# Altium schematic sheet MCU.SchDoc
size D; SheetNumber: 3; SheetTotal: 7
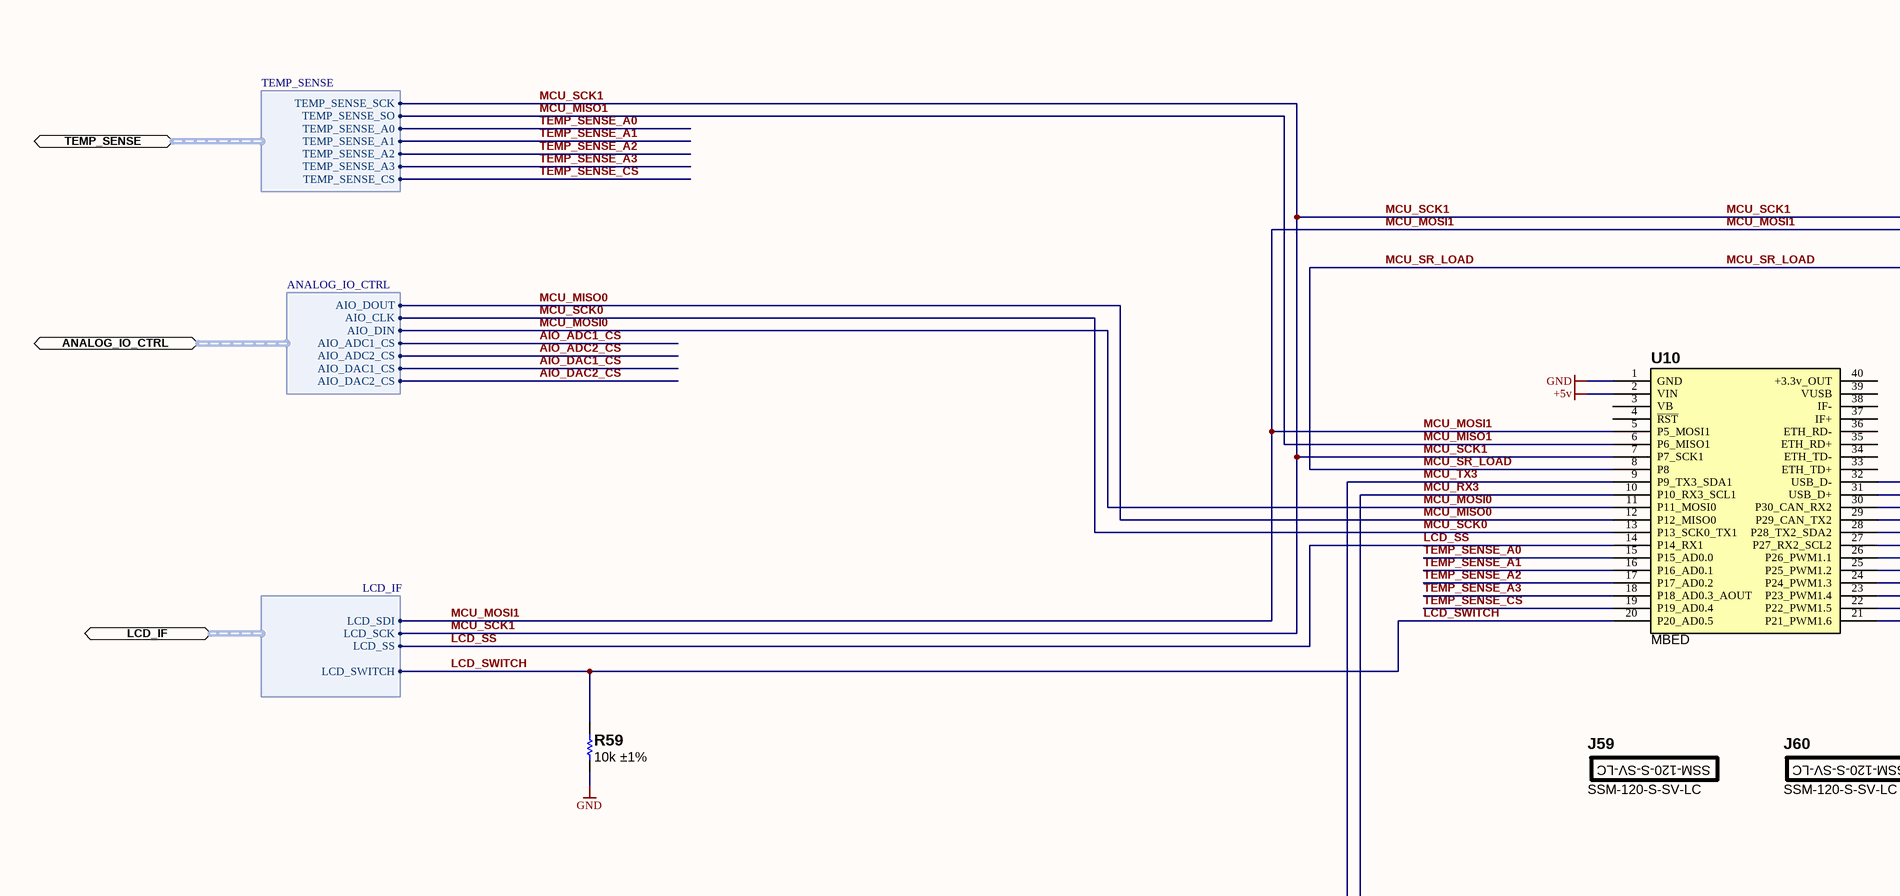
[diagram p0: MCU.SchDoc, top left]
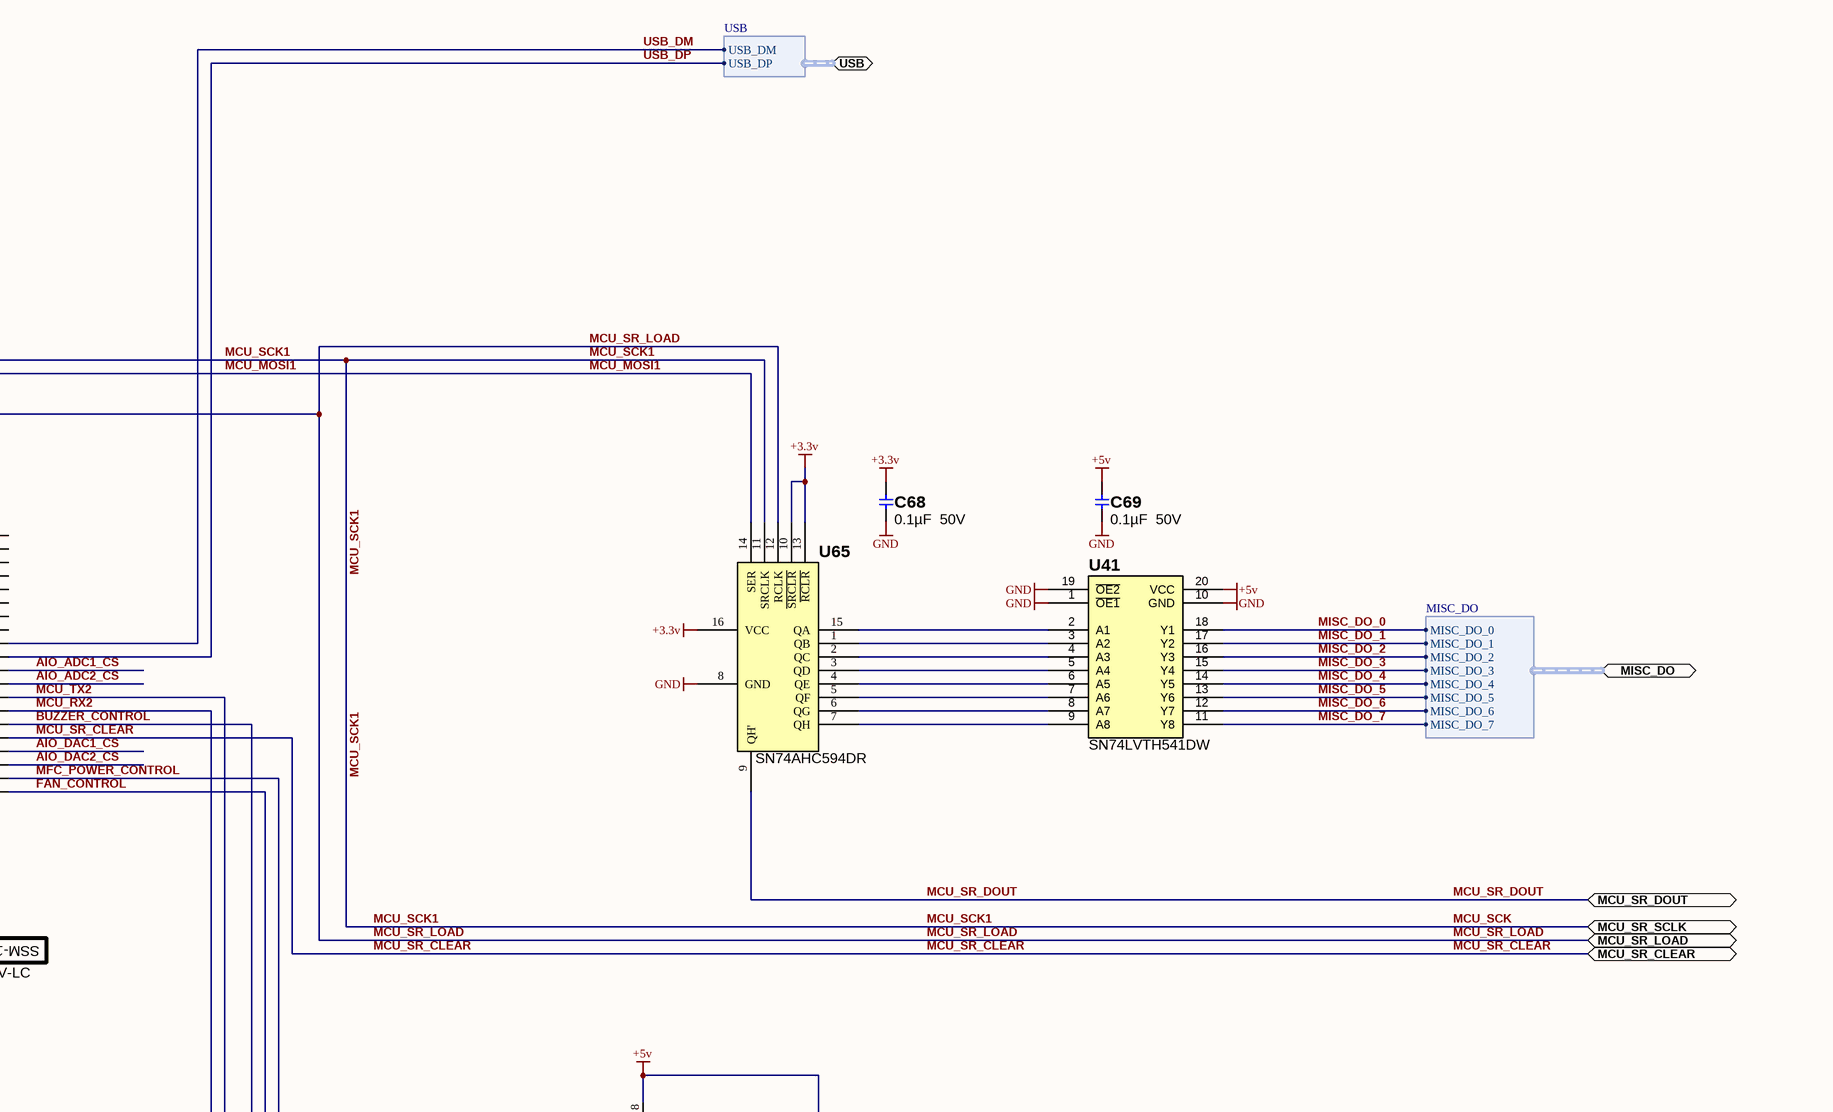
[diagram p1: MCU.SchDoc, top right]
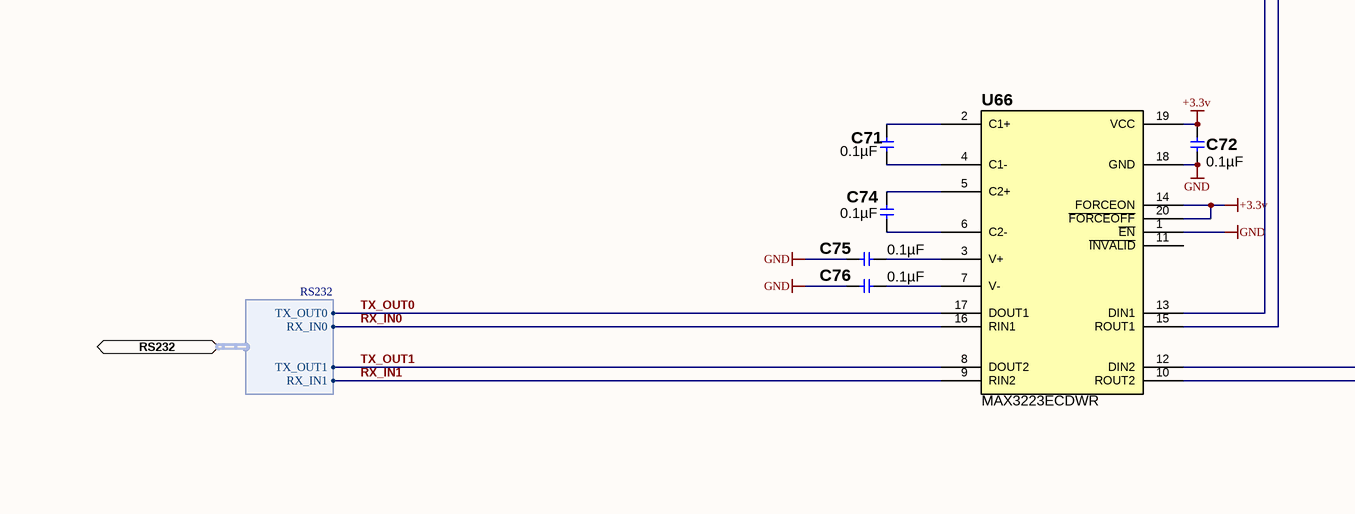
[diagram p2: MCU.SchDoc, bottom left]
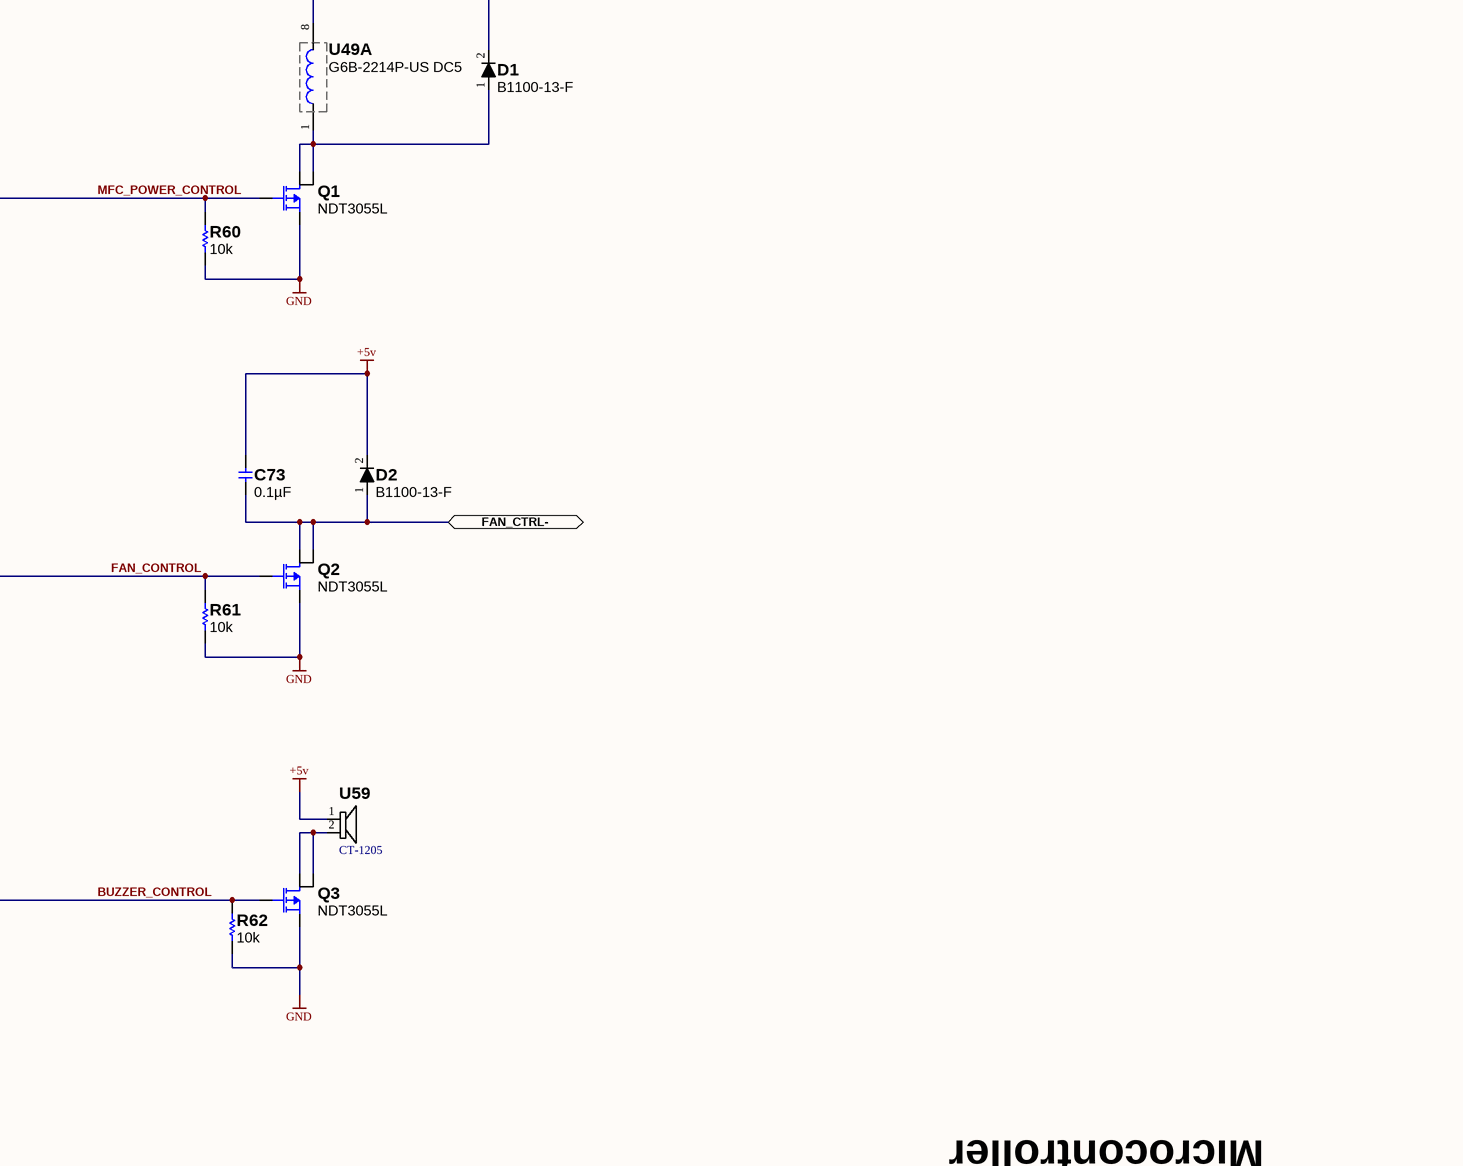
[diagram p3: MCU.SchDoc, bottom right]

## Parts
C68  0.1µF  50V  [C0805_LD]
C69  0.1µF  50V  [C0805_LD]
C71  0.1µF  [C0805_LD]
C72  0.1µF  [C0805_LD]
C73  0.1µF  [C0805_LD]
C74  0.1µF  [C0805_LD]
C75  0.1µF  [C0805_LD]
C76  0.1µF  [C0805_LD]
D1  B1100-13-F  [D_SMA_P]
D2  B1100-13-F  [D_SMA_P]
J59  SSM-120-S-SV-LC  (mechanical)
J60  SSM-120-S-SV-LC  (mechanical)
Q1  NDT3055L  [SOT223]
Q2  NDT3055L  [SOT223]
Q3  NDT3055L  [SOT223]
R59  10k ±1%  [R0805_LD]
R60  10k  [R0805_LD]
R61  10k  [R0805_LD]
R62  10k  [R0805_LD]
U10  MBED  [MBED_SURFACEMOUNT_SOCKET]
U41  SN74LVTH541DW  [SOIC127P1030X265-20L]
U49  G6B-2214P-US DC5  [G6B-2214P-US]  (part A of 2)
U59  CT-1205  [CT-1205]
U65  SN74AHC594DR  [SOIC127P600X145-16L]
U66  MAX3223ECDWR  [SOIC127P1030X265-20L]

## Ports
ANALOG_IO_CTRL (harness ANALOG_IO_CTRL), FAN_CTRL-, LCD_IF (harness LCD_IF), MCU_SR_CLEAR, MCU_SR_DOUT, MCU_SR_LOAD, MCU_SR_SCLK, MISC_DO (harness MISC_DO), RS232 (harness RS232), TEMP_SENSE (harness TEMP_SENSE), USB (harness USB)

## Harnesses
ANALOG_IO_CTRL: AIO_DOUT, AIO_CLK, AIO_DIN, AIO_ADC1_CS, AIO_ADC2_CS, AIO_DAC1_CS, AIO_DAC2_CS
TEMP_SENSE: TEMP_SENSE_SCK, TEMP_SENSE_SO, TEMP_SENSE_A0, TEMP_SENSE_A1, TEMP_SENSE_A2, TEMP_SENSE_A3, TEMP_SENSE_CS
LCD_IF: LCD_SWITCH, LCD_SDI, LCD_SCK, LCD_SS
MISC_DO: MISC_DO_0, MISC_DO_1, MISC_DO_2, MISC_DO_3, MISC_DO_4, MISC_DO_5, MISC_DO_6, MISC_DO_7
RS232: TX_OUT0, RX_IN0, TX_OUT1, RX_IN1
USB: USB_DM, USB_DP

## Nets
+3.3v: C68.2 C72.2 U65.10(~{SRCLR}) U65.13(~{RCLR}) U65.16(VCC) U66.14(FORCEON) U66.19(VCC) U66.20(~{FORCEOFF})
+5v: C69.2 C73.2 D1.2(K) D2.2(K) U10.2(VIN) U41.20(VCC) U49.8 U59.1(+)
GND: C68.1 C69.1 C72.1 C75.1 C76.1 Q1.3(S) Q2.3(S) Q3.3(S) R59.1 R60.1 R61.1 R62.1 U10.1(GND) U41.1(~{OE1}) U41.10(GND) U41.19(~{OE2}) U65.8(GND) U66.1(~{EN}) U66.18(GND)
AIO_ADC1_CS: U10.30(P30_CAN_RX2) ; port ANALOG_IO_CTRL.AIO_ADC1_CS
AIO_ADC2_CS: U10.29(P29_CAN_TX2) ; port ANALOG_IO_CTRL.AIO_ADC2_CS
AIO_DAC1_CS: U10.24(P24_PWM1.3) ; port ANALOG_IO_CTRL.AIO_DAC1_CS
AIO_DAC2_CS: U10.23(P23_PWM1.4) ; port ANALOG_IO_CTRL.AIO_DAC2_CS
BUZZER_CONTROL: Q3.1(G) R62.2 U10.26(P26_PWM1.1)
FAN_CONTROL: Q2.1(G) R61.2 U10.21(P21_PWM1.6)
FAN_CTRL-: C73.1 D2.1(A) Q2.2(D) Q2.4(D) ; port FAN_CTRL-
LCD_SS: U10.14(P14_RX1) ; port LCD_IF.LCD_SS
LCD_SWITCH: R59.2 U10.20(P20_AD0.5) ; port LCD_IF.LCD_SWITCH
MCU_MISO0: U10.12(P12_MISO0) ; port ANALOG_IO_CTRL.AIO_DOUT
MCU_MISO1: U10.6(P6_MISO1) ; port TEMP_SENSE.TEMP_SENSE_SO
MCU_MOSI0: U10.11(P11_MOSI0) ; port ANALOG_IO_CTRL.AIO_DIN
MCU_MOSI1: U10.5(P5_MOSI1) U65.14(SER) ; port LCD_IF.LCD_SDI
MCU_RX2: U10.27(P27_RX2_SCL2) U66.10(ROUT2)
MCU_RX3: U10.10(P10_RX3_SCL1) U66.15(ROUT1)
MCU_SCK: U10.7(P7_SCK1) U65.11(SRCLK) ; port MCU_SR_SCLK, port TEMP_SENSE.TEMP_SENSE_SCK, port LCD_IF.LCD_SCK  [also labelled MCU_SCK1]
MCU_SCK0: U10.13(P13_SCK0_TX1) ; port ANALOG_IO_CTRL.AIO_CLK
MCU_SR_CLEAR: U10.25(P25_PWM1.2) ; port MCU_SR_CLEAR
MCU_SR_DOUT: U65.9(QH') ; port MCU_SR_DOUT
MCU_SR_LOAD: U10.8(P8) U65.12(RCLK) ; port MCU_SR_LOAD
MCU_TX2: U10.28(P28_TX2_SDA2) U66.12(DIN2)
MCU_TX3: U10.9(P9_TX3_SDA1) U66.13(DIN1)
MFC_POWER_CONTROL: Q1.1(G) R60.2 U10.22(P22_PWM1.5)
MISC_DO_0: U41.18(Y1) ; port MISC_DO.MISC_DO_0
MISC_DO_1: U41.17(Y2) ; port MISC_DO.MISC_DO_1
MISC_DO_2: U41.16(Y3) ; port MISC_DO.MISC_DO_2
MISC_DO_3: U41.15(Y4) ; port MISC_DO.MISC_DO_3
MISC_DO_4: U41.14(Y5) ; port MISC_DO.MISC_DO_4
MISC_DO_5: U41.13(Y6) ; port MISC_DO.MISC_DO_5
MISC_DO_6: U41.12(Y7) ; port MISC_DO.MISC_DO_6
MISC_DO_7: U41.11(Y8) ; port MISC_DO.MISC_DO_7
RX_IN0: U66.16(RIN1) ; port RS232.RX_IN0
RX_IN1: U66.9(RIN2) ; port RS232.RX_IN1
TEMP_SENSE_A0: U10.15(P15_AD0.0) ; port TEMP_SENSE.TEMP_SENSE_A0
TEMP_SENSE_A1: U10.16(P16_AD0.1) ; port TEMP_SENSE.TEMP_SENSE_A1
TEMP_SENSE_A2: U10.17(P17_AD0.2) ; port TEMP_SENSE.TEMP_SENSE_A2
TEMP_SENSE_A3: U10.18(P18_AD0.3_AOUT) ; port TEMP_SENSE.TEMP_SENSE_A3
TEMP_SENSE_CS: U10.19(P19_AD0.4) ; port TEMP_SENSE.TEMP_SENSE_CS
TX_OUT0: U66.17(DOUT1) ; port RS232.TX_OUT0
TX_OUT1: U66.8(DOUT2) ; port RS232.TX_OUT1
USB_DM: U10.32(USB_D-) ; port USB.USB_DM
USB_DP: U10.31(USB_D+) ; port USB.USB_DP
NetC71_1: C71.1 U66.4(C1-)
NetC71_2: C71.2 U66.2(C1+)
NetC74_1: C74.1 U66.6(C2-)
NetC74_2: C74.2 U66.5(C2+)
NetC75_2: C75.2 U66.3(V+)
NetC76_2: C76.2 U66.7(V-)
NetD1_1: D1.1(A) Q1.2(D) Q1.4(D) U49.1
NetQ3_2: Q3.2(D) Q3.4(D) U59.2(-)
NetU41_2: U41.2(A1) U65.15(QA)
NetU41_3: U41.3(A2) U65.1(QB)
NetU41_4: U41.4(A3) U65.2(QC)
NetU41_5: U41.5(A4) U65.3(QD)
NetU41_6: U41.6(A5) U65.4(QE)
NetU41_7: U41.7(A6) U65.5(QF)
NetU41_8: U41.8(A7) U65.6(QG)
NetU41_9: U41.9(A8) U65.7(QH)

Not connected (* = marked no-connect by the designer): U10 3(VB) 4(~{RST}) 33(ETH_TD+) 34(ETH_TD-) 35(ETH_RD+) 36(ETH_RD-) 37(IF+) 38(IF-) 39(VUSB) 40(+3.3v_OUT); U66 11(~{INVALID})

## Notes on the sheet
- Microcontroller
- -1
- Wavenumber LLC
- 2pl
- Rev:
- Sheet
- of

## Library data of the parts
C68 C69 C71-C76 = GRM21BR71H104KA01L: CAP CER 0.1UF 50V 10% X7R 0805; Manufacturer: Murata Electronics North America; Temperature Coefficient: X7R; Manufacturer Part Number: GRM21BR71H104KA01L; ComponentLink1Description: \\altium.sil.arl.psu.edu\Libraries\datasheets\Murata Electronics North America\c02e.pdf; ComponentLink1URL: http://search.murata.co.jp/Ceramy/image/img/A01X/G101/ENG/GRM1555C1HR60WA01-01.pdf; ComponentLink2Description: External Datasheet; ComponentLink2URL: http://www.murata.com/products/catalog/pdf/c02e.pdf; Stocked: 0; Supplier 1: Digi-Key; Supplier Part Number 1: 490-1666-1-ND; Category: Capacitors; Sort Value: 100000; Sort Value Package: 0805_100000; Pricing: 1 = 0.1  ;  10 = 0.046  ;  50 = 0.0248  ;  100 = 0.0209  ;  250 = 0.01712  ;  500 = 0.01464  ;  1000 = 0.0114 (USD); Sales Status: Active; Capacitance: 0.1µF; Voltage - Rated: 50V; Tolerance: ±10%; Mounting Type: Surface Mount- MLCC; Operating Temperature: -55°C ~ 125°C; Applications: General Purpose; Ratings: -; Package / Case: 0805 (2012 Metric); Size / Dimension: 0.079" L x 0.049" W (2.00mm x 1.25mm); Height - Seated (Max): -; Thickness (Max): 0.053" (1.35mm); Lead Spacing: -; Features: -; Packaging: Cut Tape (CT); Lead Style: -; Package: 0805; Thickness: 135
  C68 C69: Value: 0.1µF  50V
  C71-C76: Value: 0.1µF
D1 D2 = B1100-13-F: DIODE SCHOTTKY 100V 1A SMA; Manufacturer: Diodes Inc; CategorySort: 400; Voltage - Forward (Vf) (Max) @ If: 790mV @ 1A; Speed: Fast Recovery =< 500ns- > 200mA (Io); Current - Reverse Leakage @ Vr: 500µA @ 100V; Capacitance @ Vr- F: 80pF @ 4V- 1MHz; Num Pins: 2; Diode Suffix: 1A_2C; Category: Diodes; Value: B1100-13-F; Manufacturer Part Number: B1100-13-F; ComponentLink1Description: Internal Datasheet; ComponentLink1URL: http://www.diodes.com/datasheets/ds30018.pdf; ComponentLink2Description: External Datasheet; ComponentLink2URL: http://www.diodes.com/datasheets/ds30018.pdf; Stocked: -; Supplier 1: Digi-Key; Supplier Part Number 1: B1100-FDICT-ND; SortValue: B1100-13-F; Pricing: 1 = 0.57  ;  10 = 0.4  ;  25 = 0.3288  ;  100 = 0.2627  ;  250 = 0.1914  ;  500 = 0.15544  ;  1000 = 0.11948  ;  2500 = 0.1073 (USD); Sales Status: Active; Diode Type: Schottky; Voltage - DC Reverse (Vr) (Max): 100V; Current - Average Rectified (Io): 1A; Reverse Recovery Time (trr): -; Mounting Type: Surface Mount; Package / Case: DO-214AC- SMA; Supplier Device Package: SMA; Packaging: Cut Tape (CT)
J59 J60 = SSM-120-S-SV-LC (BOM ITEM): SAMTEC - SSM-120-S-SV-LC - .025 SOCKET STRIPS; Supplier 1: Newark; Manufacturer: SAMTEC; Manufacturer Part Number: SSM-120-S-SV-LC; Stock 1: 0; Pricing 1: 1=4.98, 12500=4.38, 25000=4.14 (USD); Supplier Part Number 1: 81P6611
Q1-Q3 = NDT3055L: MOSFET N-CH 60V 4A SOT-223-4; Manufacturer: Fairchild Semiconductor; FET Type: MOSFET N-Channel, Metal Oxide; FET Feature: Logic Level Gate; Rds On (Max) @ Id, Vgs: 100 mOhm @ 4A, 10V; Vgs(th) (Max) @ Id: 2V @ 250µA; Gate Charge (Qg) @ Vgs: 20nC @ 10V; Input Capacitance (Ciss) @ Vds: 345pF @ 25V; Power - Max: 1.1W; Value: NDT3055L; Supplier 1: Digi-Key; Manufacturer Part Number: NDT3055L; RoHS: RoHS Compliant; Category: Discrete Semiconductor Products; Stock 1: 18949; Pricing 1: 1=0.69, 10=0.599, 100=0.4725, 250=0.40952, 500=0.3465, 750=0.29925, 1000=0.27563, 2000=0.252 (USD); Drain to Source Voltage (Vdss): 60V; Current - Continuous Drain (Id) @ 25° C: 4A; Mounting Type: Surface Mount; Package / Case: TO-261-4, TO-261AA; Packaging: Cut Tape (CT); Supplier Device Package: SOT-223-3; ComponentLink1URL: http://www.fairchildsemi.com/ds/ND/NDT3055L.pdf; ComponentLink1Description: http://www.fairchildsemi.com/ds/ND/NDT3055L.pdf; Supplier Part Number 1: NDT3055LCT-ND
R59-R62 = ERJ-6ENF1002V: RES 10K OHM 1/8W 1% 0805 SMD; Manufacturer: Panasonic Electronic Components; Package Power: 0805  (0.125W); Power (Watts): 0.125W- 1/8W; Temperature Coefficient: ±100ppm/°C; Limiting Element Voltage: 150; Maximum Overload Voltage: 200; Maximum Working Voltage: 35.4V; Manufacturer Part Number: ERJ-6ENF1002V; ComponentLink1Description: Internal Datasheet; ComponentLink1URL: \\altium.sil.arl.psu.edu\Libraries\datasheets\Panasonic Electronic Components\AOA0000CE2.pdf; ComponentLink2Description: External Datasheet; ComponentLink2URL: http://industrial.panasonic.com/www-data/pdf/AOA0000/AOA0000CE2.pdf; Stocked: 0; Supplier 1: Digi-Key; Supplier Part Number 1: P10.0KCCT-ND; Category: Resistors; Resistance (Ohms): 10k; Composition: Thick Film; Features: -; Tolerance: ±1%; Package / Case: 0805 (2012 Metric); Footprint: 805; Size / Dimension: 0.079" L x 0.049" W (2.00mm x 1.25mm); Height: 0.028" (0.70mm); Number of Terminations: 2; Packaging: Cut Tape (CT); Sort Value: 10000; Sort Value Package: 805_10000
  R59: Value: 10k ±1%
  R60-R62: Value: 10k
U10 = OM11043: DEVELOPMENT BOARD LPC1768 MBED; Manufacturer: NXP Semiconductors; Contents: Board and software; Value: MBED; Supplier 1: Digi-Key; Supplier Part Number 1: 568-4916-ND; Manufacturer Part Number: OM11043; RoHS: RoHS Compliant; Category: Programmers, Development Systems; Stock 1: 376; Pricing 1: 1=59 (USD); Type: MCU; For Use With/Related Products: LPC1768; ComponentLink1URL: http://ics.nxp.com/products/lpc1000/datasheet/lpc1763.lpc1764.lpc1765.lpc1766.lpc1767.lpc1768.lpc1769.pdf; ComponentLink1Description: http://ics.nxp.com/products/lpc1000/datasheet/lpc1763.lpc1764.lpc1765.lpc1766.lpc1767.lpc1768.lpc1769.pdf
U41 = SN74LVTH541DW: IC BUFF/DVR TRI-ST 8BIT 20SOIC; Manufacturer: Texas Instruments; Logic Type: Buffer/Line Driver, Non-Inverting; Number of Elements: 1; Number of Bits per Element: 8; Current - Output High, Low: 32mA, 64mA; Voltage - Supply: 2.7 V ~ 3.6 V; Value: SN74LVTH541DW; Supplier 1: Digi-Key; Supplier Part Number 1: 296-8728-5-ND; Manufacturer Part Number: SN74LVTH541DW; RoHS: RoHS Compliant; Category: Integrated Circuits (ICs); Stock 1: 8053; Pricing 1: 1=2.02, 25=1.6252, 100=1.4625, 250=1.3, 500=1.1375, 1000=0.9425, 2500=0.8775, 5000=0.845, 10000=0.8125 (USD); Packaging: Tube; Operating Temperature: -40°C ~ 85°C; Mounting Type: Surface Mount; Package / Case: 20-SOIC (0.295", 7.50mm Width); Supplier Device Package: 20-SOIC; ComponentLink1URL: http://www.ti.com/lit/ds/symlink/sn74lvth541.pdf; ComponentLink1Description: http://www.ti.com/lit/ds/symlink/sn74lvth541.pdf
U49 = G6B-2214P-US DC5: RELAY GENERAL PURPOSE DPST 5A 5V; Manufacturer: Omron Electronics Inc-EMC Div; Coil Type: Non Latching; Coil Current: 60mA; Coil Voltage: 5VDC; Contact Form: DPST (2 Form A); Switching Voltage: 380VAC, 125VDC - Max; Turn On Voltage (Max): 4 VDC; Turn Off Voltage (Min): 0.5 VDC; Operate Time: 10ms; Coil Power: 300 mW; Coil Resistance: 83.3 Ohms; Supplier 1: Digi-Key; Supplier Part Number 1: Z947-ND; Manufacturer Part Number: G6B-2214P-US DC5; RoHS: RoHS Compliant; Category: Relays; Stock 1: 2840; Pricing 1: 1=7.27, 10=6.816, 25=6.0584, 50=5.7556, 100=5.4526, 250=4.84676, 500=4.54384, 1000=4.24092, 2500=4.16519 (USD); Packaging: Bulk; Relay Type: General Purpose; Contact Rating (Current): 5A; Release Time: 10ms; Features: Sealed - Fully; Mounting Type: Through Hole; Termination Style: PC Pin; Contact Material: Silver Alloy, Cadmium Free; Operating Temperature: -25°C ~ 70°C; ComponentLink1URL: http://www.components.omron.com/components/web/PDFLIB.nsf/0/4287C4A29AD8E88785257201007DD690/$file/G6B_0911.pdf; ComponentLink1Description: http://www.components.omron.com/components/web/PDFLIB.nsf/0/4287C4A29AD8E88785257201007DD690/$file/G6B_0911.pdf; Value: G6B-2214P-US DC5
U59 = CT-1205: Source Part Number: 102-1199-2-ND; Manufacturer: CUI Inc; Driver Circuitry: Transducer, Externally Driven; Input Type: zero-peak Signal; Voltage - Rated: 5Vo-p; Voltage Range: 3 ~ 8V; Frequency: 2.4kHz; Operating Mode: Continuous; Sound Pressure Level: 87dB @ 5V, 10cm; Current - Supply: 40mA; Washable: Yes; Source: Digikey; Manufacturer Part Number: CT-1205; ROHS Certificate: *; Supplier 1: Digi-Key; Supplier Part Number 1: 102-1199-6-ND; RoHS: RoHS Compliant; Category: Audio Products; Stock 1: 10608; Pricing 1: 1=2.68, 10=2.222, 100=1.6456 (USD); Packaging: Digi-Reel®; Technology: Magnetic; Mounting Type: Surface Mount; Termination: Solder Pads; Size / Dimension: Square - 12.80mm L x 12.80mm W x 7.60mm H; Capacitance @ Frequency: -; Operating Temperature: -30°C ~ 85°C; ComponentLink1URL: http://www.cui.com/product/resource/digikeypdf/ct-1205-smt.pdf; ComponentLink1Description: http://www.cui.com/product/resource/digikeypdf/ct-1205-smt.pdf; Value: CT-1205
U65 = SN74AHC594DR: IC SHIFT REGISTER 8BIT 16-SOIC; Manufacturer: Texas Instruments; Output Type: Standard; Number of Elements: 1; Number of Bits per Element: 8; Function: Serial to Parallel; Voltage - Supply: 2 V ~ 5.5 V; Supplier 1: Digi-Key; Manufacturer Part Number: SN74AHC594DR; RoHS: RoHS Compliant; Category: Integrated Circuits (ICs); Stock 1: 1808; Pricing 1: 1=0.59, 10=0.494, 25=0.4332, 100=0.3708, 250=0.3216, 500=0.2724, 1000=0.21 (USD); Packaging: Cut Tape (CT); Logic Type: Shift Register; Operating Temperature: -40°C ~ 85°C; Mounting Type: Surface Mount; Package / Case: 16-SOIC (0.154", 3.90mm Width); Supplier Device Package: 16-SOIC N; ComponentLink1URL: http://www.ti.com/lit/ds/symlink/sn74ahc594.pdf; ComponentLink1Description: http://www.ti.com/lit/ds/symlink/sn74ahc594.pdf; Supplier Part Number 1: 296-31743-1-ND; Value: SN74AHC594DR
U66 = MAX3223ECDWR: IC RS232 3V5.5V DRVR ESD 20-SOIC; Manufacturer: Texas Instruments; Number of Drivers/Receivers: 2/2; Duplex: Full; Receiver Hysteresis: 500mV; Data Rate: 500kbps; Voltage - Supply: 3 V ~ 5.5 V; Value: MAX3223ECDWR; Supplier 1: Digi-Key; Supplier Part Number 1: 296-19839-1-ND; Manufacturer Part Number: MAX3223ECDWR; RoHS: RoHS Compliant; Category: Integrated Circuits (ICs); Stock 1: 2550; Pricing 1: 1=2.23, 10=2.016, 25=1.806, 100=1.624, 250=1.442, 500=1.26, 1000=1.043 (USD); Packaging: Cut Tape (CT); Type: Transceiver; Protocol: RS232; Operating Temperature: 0°C ~ 70°C; Mounting Type: Surface Mount; Package / Case: 20-SOIC (0.295", 7.50mm Width); Supplier Device Package: 20-SOIC; ComponentLink1URL: http://www.ti.com/lit/ds/symlink/max3223e.pdf; ComponentLink1Description: http://www.ti.com/lit/ds/symlink/max3223e.pdf